# Altium schematic sheet ADC_PLL.SchDoc: RFSoC AMC
size 420 x 297 mm; CompanyName: WUT; DrawnBy: T. Przywozki; Organization: WUT ISE; Address1: Warsaw University of Technology; Address2: Nowowiejska 15/19 00-665 Warsaw; Address3: Tomasz.Przywozki@pw.edu.pl; DocumentNumber: 19; Revision: 1; SheetNumber: 19; SheetTotal: 45; Project: RFSoC AMC; ModifiedBy: T. Przywozki; CreateDate: -; CheckedDate: -; DivGrp: ISE; Designer: T. Przywozki; ModifiedDate: -; ProjectName: ADC/DAC MEZZANINE
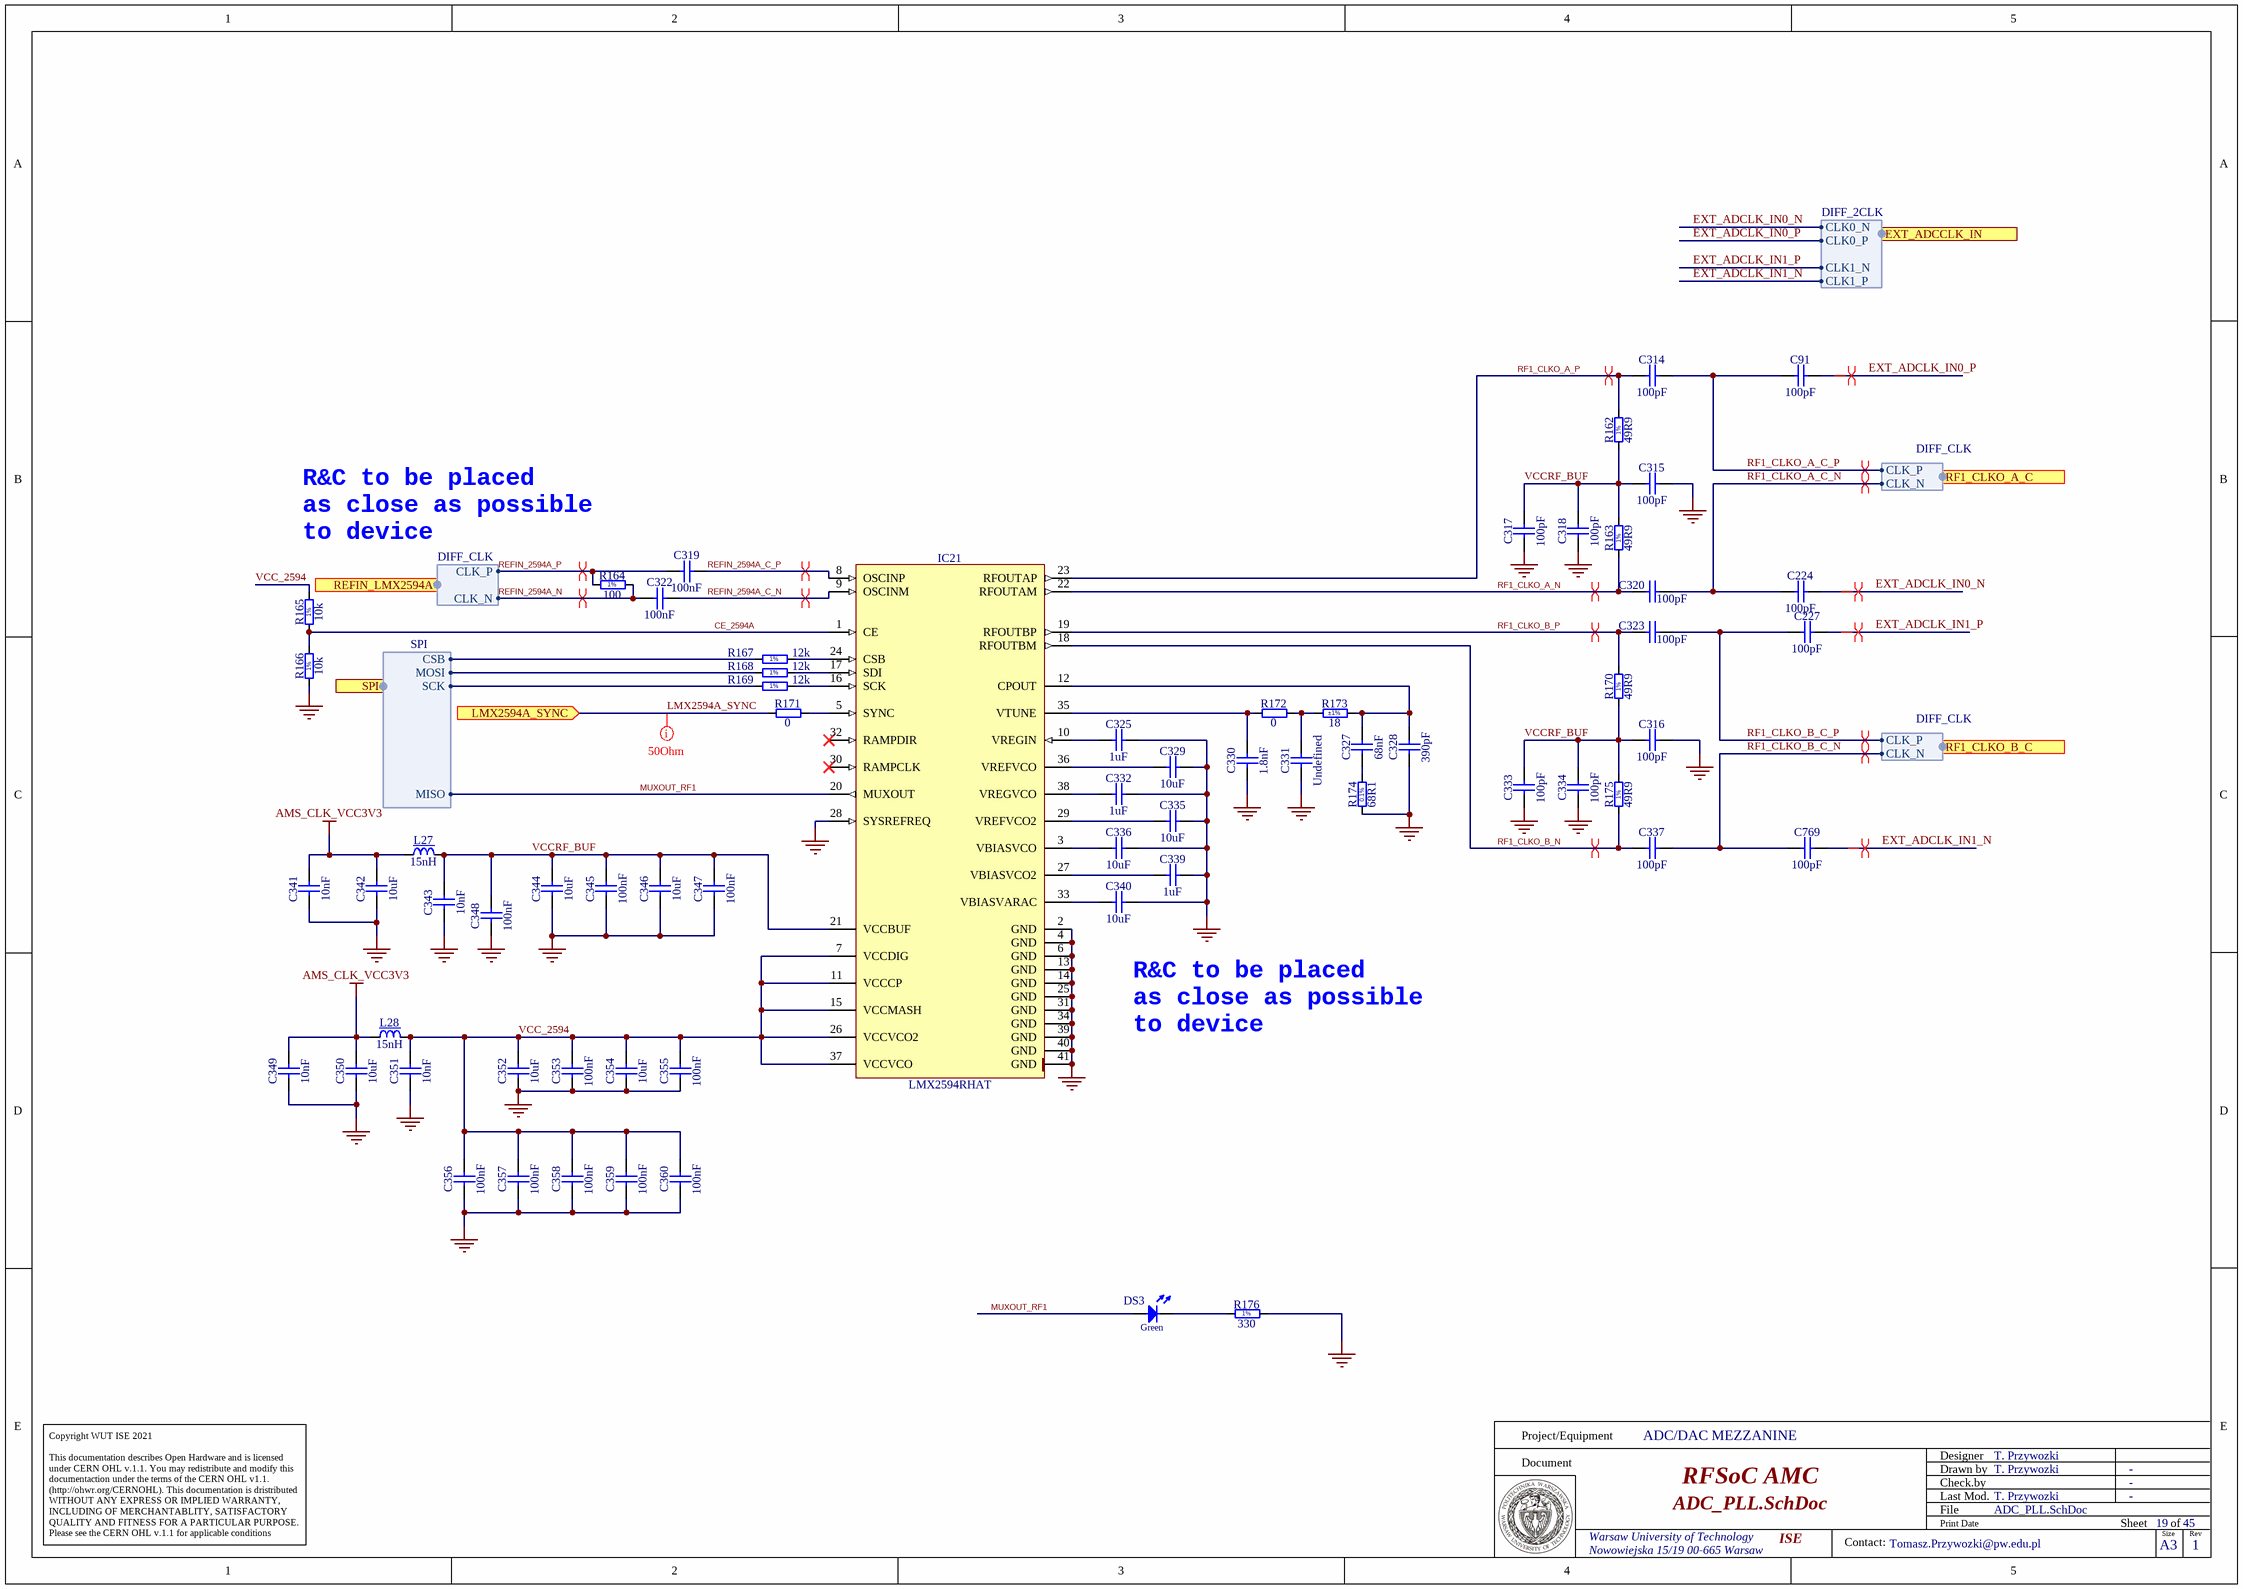
[diagram p0: ADC_PLL.SchDoc]

## Parts
C91  100pF  [CAPC1005X55N]
C224  100pF  [CAPC1005X55N]
C227  100pF  [CAPC1005X55N]
C314  100pF  [CAPC1005X55N]
C315  100pF  [CAPC1005X55N]
C316  100pF  [CAPC1005X55N]
C317  100pF  [CAPC1005X55N]
C318  100pF  [CAPC1005X55N]
C319  100nF  [CAPC1005X55N]
C320  100pF  [CAPC1005X55N]
C322  100nF  [CAPC1005X55N]
C323  100pF  [CAPC1005X55N]
C325  1uF  [CAPC1005X55N]
C327  68nF  [CAPC1005X55N]
C328  390pF  [CAPC1608X87N]
C329  10uF  [CAPC1608X80N]
C330  1.8nF  [CAPC1608X87N]
C331  Undefined  [CAPC1005X55N]
C332  1uF  [CAPC1005X55N]
C333  100pF  [CAPC1005X55N]
C334  100pF  [CAPC1005X55N]
C335  10uF  [CAPC1608X80N]
C336  10uF  [CAPC1608X80N]
C337  100pF  [CAPC1005X55N]
C339  1uF  [CAPC1005X55N]
C340  10uF  [CAPC1608X80N]
C341  10nF  [CAPC1005X55N]
C342  10uF  [CAPC1608X80N]
C343  10nF  [CAPC1005X55N]
C344  10uF  [CAPC1608X80N]
C345  100nF  [CAPC1005X55N]
C346  10uF  [CAPC1608X80N]
C347  100nF  [CAPC1005X55N]
C348  100nF  [CAPC1005X55N]
C349  10nF  [CAPC1005X55N]
C350  10uF  [CAPC1608X80N]
C351  10nF  [CAPC1005X55N]
C352  10uF  [CAPC1608X80N]
C353  100nF  [CAPC1005X55N]
C354  10uF  [CAPC1608X80N]
C355  100nF  [CAPC1005X55N]
C356  100nF  [CAPC1005X55N]
C357  100nF  [CAPC1005X55N]
C358  100nF  [CAPC1005X55N]
C359  100nF  [CAPC1005X55N]
C360  100nF  [CAPC1005X55N]
C769  100pF  [CAPC1005X55N]
DS3  Green  [LED_OSRAM_LGL29K]
IC21  LMX2594RHAT  [QFN50P600X600X100-41N-S460]
L27  15nH  [IND_COILCRAFT_0402DC]
L28  15nH  [IND_COILCRAFT_0402DC]
R162  49R9  [RESC1005X40N]
R163  49R9  [RESC1005X40N]
R164  100  [RESC1005X40N]
R165  10k  [RESC1005X40N]
R166  10k  [RESC1005X40N]
R167  12k  [RESC1005X40N]
R168  12k  [RESC1005X40N]
R169  12k  [RESC1005X40N]
R170  49R9  [RESC1005X40N]
R171  0  [RESC1005X40N]
R172  0  [RESC1005X40N]
R173  18  Tolerance: ±1%  [RESC1005X40N]
R174  68R1  [RESC1608X55N]
R175  49R9  [RESC1005X40N]
R176  330  [RESC1005X40N]

## Ports
EXT_ADCCLK_IN (harness DIFF_2CLK), LMX2594A_SYNC (in), REFIN_LMX2594A (harness DIFF_CLK), RF1_CLKO_A_C (harness DIFF_CLK), RF1_CLKO_B_C (in, harness DIFF_CLK), SPI (harness SPI)

## Harnesses
DIFF_CLK: CLK_P, CLK_N
SPI: MOSI, MISO, CSB, SCK
DIFF_2CLK: CLK0_P, CLK0_N, CLK1_P, CLK1_N

## Nets
AMS_CLK_VCC3V3: C341.2 C342.2 C349.2 C350.2 L27.1 L28.1
GND: C315.2 C316.2 C317.1 C318.1 C325.1 C328.1 C329.1 C330.1 C331.1 C332.1 C333.1 C334.1 C335.1 C336.1 C339.1 C340.1 C341.1 C342.1 C343.1 C344.1 C345.1 C346.1 C347.1 C348.1 C349.1 C350.1 C351.1 C352.1 C353.1 C354.1 C355.1 C356.1 C357.1 C358.1 C359.1 C360.1 IC21.2(GND) IC21.4(GND) IC21.6(GND) IC21.13(GND) IC21.14(GND) IC21.25(GND) IC21.28(SYSREFREQ) IC21.31(GND) IC21.34(GND) IC21.39(GND) IC21.40(GND) IC21.41(GND) R166.1 R174.1 R176.2
CE_2594A: IC21.1(CE) R165.1 R166.2
EXT_ADCLK_IN0_N: C224.2 ; port EXT_ADCCLK_IN.CLK0_N
EXT_ADCLK_IN0_P: C91.2 ; port EXT_ADCCLK_IN.CLK0_P
EXT_ADCLK_IN1_N: C769.2 ; port EXT_ADCCLK_IN.CLK1_P
EXT_ADCLK_IN1_P: C227.2 ; port EXT_ADCCLK_IN.CLK1_N
LMX2594A_SYNC: R171.1 ; port LMX2594A_SYNC
MUXOUT_RF1: DS3.2(A) IC21.20(MUXOUT) ; port SPI.MISO
REFIN_2594A_C_N: C322.2 IC21.9(OSCINM)
REFIN_2594A_C_P: C319.2 IC21.8(OSCINP)
REFIN_2594A_N: C322.1 R164.2 ; port REFIN_LMX2594A.CLK_N
REFIN_2594A_P: C319.1 R164.1 ; port REFIN_LMX2594A.CLK_P
RF1_CLKO_A_C_N: C224.1 C320.2 ; port RF1_CLKO_A_C.CLK_N
RF1_CLKO_A_C_P: C91.1 C314.2 ; port RF1_CLKO_A_C.CLK_P
RF1_CLKO_A_N: C320.1 IC21.22(RFOUTAM) R163.1
RF1_CLKO_A_P: C314.1 IC21.23(RFOUTAP) R162.2
RF1_CLKO_B_C_N: C337.2 C769.1 ; port RF1_CLKO_B_C.CLK_N
RF1_CLKO_B_C_P: C227.1 C323.2 ; port RF1_CLKO_B_C.CLK_P
RF1_CLKO_B_N: C337.1 IC21.18(RFOUTBM) R175.1
RF1_CLKO_B_P: C323.1 IC21.19(RFOUTBP) R170.2
VCC_2594: C351.2 C352.2 C353.2 C354.2 C355.2 C356.2 C357.2 C358.2 C359.2 C360.2 IC21.7(VCCDIG) IC21.11(VCCCP) IC21.15(VCCMASH) IC21.26(VCCVCO2) IC21.37(VCCVCO) L28.2 R165.2
VCCRF_BUF: C315.1 C316.1 C317.2 C318.2 C333.2 C334.2 C343.2 C344.2 C345.2 C346.2 C347.2 C348.2 IC21.21(VCCBUF) L27.2 R162.1 R163.2 R170.1 R175.2
NetC325_2: C325.2 IC21.10(VREGIN)
NetC327_1: C327.1 R174.2
NetC327_2: C327.2 C328.2 IC21.12(CPOUT) R173.2
NetC329_2: C329.2 IC21.36(VREFVCO)
NetC330_2: C330.2 IC21.35(VTUNE) R172.1
NetC331_2: C331.2 R172.2 R173.1
NetC332_2: C332.2 IC21.38(VREGVCO)
NetC335_2: C335.2 IC21.29(VREFVCO2)
NetC336_2: C336.2 IC21.3(VBIASVCO)
NetC339_2: C339.2 IC21.27(VBIASVCO2)
NetC340_2: C340.2 IC21.33(VBIASVARAC)
NetDS3_1: DS3.1(C) R176.1
NetIC21_5: IC21.5(SYNC) R171.2
NetIC21_16: IC21.16(SCK) R169.1
NetIC21_17: IC21.17(SDI) R168.1
NetIC21_24: IC21.24(CSB) R167.1
NetR167_2: R167.2 ; port SPI.CSB
NetR168_2: R168.2 ; port SPI.MOSI
NetR169_2: R169.2 ; port SPI.SCK

Not connected (* = marked no-connect by the designer): IC21 30(RAMPCLK)* 32(RAMPDIR)*

## Layout directives
differential pair; differential pair class Diff_100Ohm: EXT_ADCLK_IN0_N, EXT_ADCLK_IN0_P, EXT_ADCLK_IN1_N, EXT_ADCLK_IN1_P, REFIN_2594A_C_N, REFIN_2594A_C_P, REFIN_2594A_N, REFIN_2594A_P, RF1_CLKO_A_C_N, RF1_CLKO_A_C_P, RF1_CLKO_A_N, RF1_CLKO_A_P, RF1_CLKO_B_C_N, RF1_CLKO_B_C_P, RF1_CLKO_B_N, RF1_CLKO_B_P
mark named 50Ohm: LMX2594A_SYNC

## Notes on the sheet
- (near C319) R&C to be placed
  as close as possible
  to device
- R&C to be placed
  as close as possible
  to device
- Project/Equipment
- Document
- Designer
- Drawn by
- Check.by
- Copyright WUT ISE 2021
  This documentation describes Open Hardware and is licensed under CERN OHL v.1.1. You may redistribute and modify this documentaction under the terms of the CERN OHL v1.1.
  (http://ohwr.org/CERNOHL). This documentation is dristributed WITHOUT ANY EXPRESS OR IMPLIED WARRANTY, INCLUDING OF MERCHANTABLITY, SATISFACTORY QUALITY AND FITNESS FOR A PARTICULAR PURPOSE. Please see the CERN OHL v.1.1 for applicable conditions
- File
- Last Mod.
- Print Date
- Sheet
- Size
- A3
- of
- Rev
- Contact:
- (in symbol R0402_10K_1%_0.0625W_100PPM) 1%
- (in symbol R0402_12K_1%_0.0625W_100PPM) 1%
- (in symbol R0402_49R9_1%_0.0625W_100PPM) 1%
- (in symbol R0402_100R_1%_0.1W_100PPM) 1%
- (in symbol R0402_330R_1%_0.0625W_100PPM) 1%
- (in symbol R0603_68R1_0.1%_0.063W_10PPM) 0.1%

## Library data of the parts
C91 C224 C227 C314-C318 C320 C323 C333 C334 C337 C769 = CC0402_100PF_25V_5%_C0G_KEMET_HiQ-CBR: Non-polarised capacitor; Part Description: High Q and low ESR, SMD Multilayer Chip Ceramic Capacitor, HiQ-CBR Series; Manufacturer: KEMET; Manufacturer Part Number: CBR04C101J3GAC; Voltage: 25V; TC: C0G/NP0; Tolerance: ±5%; Part Number: CC0402_100PF_25V_5%_C0G_KEMET_HiQ-CBR; Component Kind: Standard; Component Type: Standard; Pin Count: 2; Value: 100pF; Status: Not Recommended; Case: 0402; Mounted: Yes; Socket: No; SMD: Yes; Sense: No; ComponentHeight: 0.55mm; HelpURL: \\cern.ch\dfs\Applications\Altium\Datasheets\CC0402_C0G_KEMET_HiQ-CBR.pdf; Author: CERN DEM MR; CreateDate: 17.11.2017; LatestRevisionDate: 21.11.2017
C319 C322 C345 C347 C348 C353 C355-C360 = CC0402_100NF_25V_10%_X7R_YUDEN_TMK105B7104KVHF: Non-polarised capacitor; Part Description: SMD Multilayer Chip Ceramic Capacitor (High Dielectric Type) for Automotive / Industrial Applications; Manufacturer: TAIYO YUDEN; Voltage: 25V; TC: X7R; Tolerance: ±10%; Part Number: CC0402_100NF_25V_10%_X7R_YUDEN_TMK105B7104KVHF; Component Kind: Standard; Component Type: Standard; Pin Count: 2; Value: 100nF; Status: Not Recommended; Manufacturer Part Number: TMK105B7104KVHF; Case: 0402; Mounted: Yes; Socket: No; SMD: Yes; Sense: No; ComponentHeight: 0.55mm; HelpURL: \\cern.ch\dfs\Applications\Altium\Datasheets\CC0402_TAIYO-YUDEN_TMK105B7104KVHF.pdf; Author: CERN DEM JLC; CreateDate: 10.05.2017; LatestRevisionDate: 10.05.2017
C325 C332 C339 = CC0402_1UF_16V_10%_X5R: Non-polarised capacitor; Part Description: SMD Multilayer Chip Ceramic Capacitor; Manufacturer: GENERIC; Manufacturer1 Part Number: C1005X5R1C105KT; Voltage: 16V; TC: X5R; Tolerance: ±10%; Part Number: CC0402_1UF_16V_10%_X5R; Component Kind: Standard; Component Type: Standard; Pin Count: 2; Value: 1uF; Status: Preferred; Manufacturer Part Number: CC0402_1UF_16V_10%_X5R; Case: 0402; Mounted: Yes; Socket: No; SMD: Yes; Sense: No; Manufacturer1 Example: TDK; Manufacturer1 ComponentHeight: 0.55mm; HelpURL: \\cern.ch\dfs\Applications\Altium\Datasheets\CC0402_X5R_TDK_C.pdf; Author: CERN DEM JLC; CreateDate: 25.10.2012; LatestRevisionDate: 25.10.2012
C327 = CC0402_68NF_16V_10%_X7R: Non-polarised capacitor; Part Description: SMD Multilayer Chip Ceramic Capacitor; Manufacturer: GENERIC; Manufacturer1 Part Number: 223878715647; Voltage: 16V; TC: X7R; Tolerance: ±10%; Part Number: CC0402_68NF_16V_10%_X7R; Component Kind: Standard; Component Type: Standard; Pin Count: 2; Value: 68nF; Status: Not Recommended; Manufacturer Part Number: CC0402_68NF_16V_10%_X7R; Case: 0402; Mounted: Yes; Socket: No; SMD: Yes; Sense: No; Manufacturer1 Example: PHYCOMP; Manufacturer1 ComponentHeight: 0.55mm; HelpURL: \\cern.ch\dfs\Applications\Altium\Datasheets\CC0402_X7R_PHYCOMP.pdf; Author: CERN DEM JLC; CreateDate: 03.12.2007; LatestRevisionDate: 03.12.2007
C328 = CC0603_390PF_50V_5%_NP0: Non-polarised capacitor; Part Description: SMD Multilayer Chip Ceramic Capacitor; Manufacturer: GENERIC; Manufacturer1 Part Number: 223886715391; Voltage: 50V; TC: NP0; Tolerance: ±5%; Part Number: CC0603_390PF_50V_5%_NP0; Component Kind: Standard; Component Type: Standard; Pin Count: 2; Value: 390pF; Status: Preferred; Manufacturer Part Number: CC0603_390PF_50V_5%_NP0; Case: 0603; Mounted: Yes; Socket: No; SMD: Yes; Sense: No; Manufacturer1 Example: PHYCOMP; Manufacturer1 ComponentHeight: 0.87mm; HelpURL: \\cern.ch\dfs\Applications\Altium\Datasheets\CC0603_NP0_PHYCOMP.pdf; Author: CERN DEM JLC; CreateDate: 03.12.2007; LatestRevisionDate: 03.12.2007
C329 C335 C336 C340 C342 C344 C346 C350 C352 C354 = CC0603_10UF_10V_10%_X5R: Non-polarised capacitor; Part Description: SMD Multilayer Chip Ceramic Capacitor; Manufacturer: GENERIC; Manufacturer1 Part Number: GRM188R61A106KE69D; Voltage: 10V; TC: X5R; Tolerance: ±10%; Part Number: CC0603_10UF_10V_10%_X5R; Component Kind: Standard; Component Type: Standard; Pin Count: 2; Value: 10uF; Status: None; Manufacturer Part Number: CC0603_10UF_10V_10%_X5R; Case: 0603; Mounted: Yes; Socket: No; SMD: Yes; Sense: No; Manufacturer1 Example: MURATA; Manufacturer1 ComponentHeight: 0.8mm; HelpURL: \\cern.ch\dfs\Applications\Altium\Datasheets\CC0603_MURATA_GRM188R61A106KE69D.pdf; Author: CERN DEM JLC; CreateDate: 31.01.2017; LatestRevisionDate: 31.01.2017
C330 = CC0603_1.8NF_50V_5%_X7R: Non-polarised capacitor; Part Description: SMD Multilayer Chip Ceramic Capacitor; Manufacturer: GENERIC; Manufacturer1 Part Number: C0603C182J5RACTU; Voltage: 50V; TC: X7R; Tolerance: ±5%; Part Number: CC0603_1.8NF_50V_5%_X7R; Component Kind: Standard; Component Type: Standard; Pin Count: 2; Value: 1.8nF; Status: Preferred; Manufacturer Part Number: CC0603_1.8NF_50V_5%_X7R; Case: 0603; Mounted: Yes; Socket: No; SMD: Yes; Sense: No; Manufacturer1 Example: KEMET; Manufacturer1 ComponentHeight: 0.87mm; HelpURL: \\cern.ch\dfs\Applications\Altium\Datasheets\CC0603_X7R_KEMET.pdf; Author: CERN DEM JLC; CreateDate: 31.05.2018; LatestRevisionDate: 31.05.2018
C331 = CC0402_NO-VALUE: Non-polarised capacitor; Part Description: Reserved Footprint For 0402(1005) Chip Ceramic Capacitor; Mounted: No; Part Number: CC0402_NO-VALUE; Component Kind: Standard; Component Type: Standard; Pin Count: 2; Value: Undefined; Status: None; Manufacturer: Undefined; Manufacturer Part Number: CC0402_NO-VALUE; Case: 0402; Socket: No; SMD: Yes; Sense: No; Manufacturer1 ComponentHeight: 0.55mm; HelpURL: Undefined; Author: CERN DEM JLC; CreateDate: 14.01.2014; LatestRevisionDate: 14.01.2014
C341 C343 C349 C351 = CC0402_10NF_16V_10%_X7R: Non-polarised capacitor; Part Description: SMD Multilayer Chip Ceramic Capacitor; Manufacturer: GENERIC; Manufacturer1 Part Number: 223878715636; Voltage: 16V; TC: X7R; Tolerance: ±10%; Part Number: CC0402_10NF_16V_10%_X7R; Component Kind: Standard; Component Type: Standard; Pin Count: 2; Value: 10nF; Status: Not Recommended; Manufacturer Part Number: CC0402_10NF_16V_10%_X7R; Case: 0402; Mounted: Yes; Socket: No; SMD: Yes; Sense: No; Manufacturer1 Example: PHYCOMP; Manufacturer1 ComponentHeight: 0.55mm; HelpURL: \\cern.ch\dfs\Applications\Altium\Datasheets\CC0402_X7R_PHYCOMP.pdf; Author: CERN DEM JLC; CreateDate: 03.12.2007; LatestRevisionDate: 03.12.2007
DS3 = LED_OSRAM_LG L29K-G2J1-24-Z: LED Green 1C 2A; Part Description: Surface Mount Green LED (0603 Case); Manufacturer: OSRAM; PressFit: No; Bonding: No; Status Comment: Sourcing Difficulty; Part Number: LED_OSRAM_LG L29K-G2J1-24-Z; Component Kind: Standard; Component Type: Standard; Color: Green; PackageDescription: Green Chip LED, 2-Leads, Body 1.7x0.8mm, IPC Medium Density; Status: Not Recommended; Manufacturer Part Number: LG L29K-G2J1-24-Z; Pin Count: 2; Case: 0603; Mounted: Yes; Socket: No; SMD: Yes; Sense: No; ComponentHeight: 0.67mm; HelpURL: \\cern.ch\dfs\Applications\Altium\Datasheets\LED_OSRAM_LGL29K.pdf; Author: CERN DEM JLC; CreateDate: 24.04.2012; LatestRevisionDate: 24.04.2012
IC21 = LMX2594RHAT: 15GHz Wideband PLLatinum RF Synthesizer with Phase Synchronization and JESD204B Support; Manufacturer: TEXAS INSTRUMENTS; PressFit: No; Bonding: No; Part Number: LMX2594RHAT; Component Kind: Standard; Component Type: Standard; Device: LMX2594RHAT; PackageDescription: QFN, 0.50mm Pitch, Square; 40 pin, 6.00mm L X 6.00mm W X 1.00mm H body (W/Thermal Tab 4.60mm x 4.60mm), IPC Medium Density; Part Description: 15GHz Wideband PLLatinum RF Synthesizer with Phase Synchronization and JESD204B Support; Manufacturer Part Number: LMX2594RHAT; Pin Count: 41; Case: QFN40; Mounted: Yes; Socket: No; SMD: Yes; Sense: No; ComponentHeight: 1mm; Author: CERN DEM JLC; HelpURL: \\cern.ch\dfs\Applications\Altium\Datasheets\LMX2594RHAT.pdf; CreateDate: 04.12.2018; LatestRevisionDate: 04.12.2018
L27 L28 = IND0402_15NH_2%_COILCRAFT_0402DC: Inductor With Core; Part Description: Ceramic Wirewound Chip Inductor, 0402DC Series; Manufacturer Part Number: 0402DC-15NXGRW; Power: 1A; Resistance: 0.115R; Tolerance: ±2%; Part Number: IND0402_15NH_2%_COILCRAFT_0402DC; Component Kind: Standard; Component Type: Standard; Pin Count: 2; Value: 15nH; Status: None; Manufacturer: COILCRAFT; Case: 0402; Mounted: Yes; Socket: No; SMD: Yes; Sense: No; ComponentHeight: 0.61mm; HelpURL: \\cern.ch\dfs\Applications\Altium\Datasheets\IND0402_COILCRAFT_0402DC.pdf; Author: CERN DEM JLC; CreateDate: 04.12.2018; LatestRevisionDate: 04.12.2018
R162 R163 R170 R175 = R0402_49R9_1%_0.0625W_100PPM: Resistor - 1%; Part Description: General Purpose Thick Film Chip Resistor; Manufacturer: GENERIC; Manufacturer1 Part Number: 232270674999L or RC0402FR-0749R9L; TC: ±100ppm/°C; PressFit: No; Part Number: R0402_49R9_1%_0.0625W_100PPM; Component Kind: Standard; Component Type: Standard; Pin Count: 2; Value: 49R9; Status: Not Recommended; Power: 0.0625W; Tolerance: ±1%; Manufacturer Part Number: R0402_49R9_1%_0.0625W_100PPM; Case: 0402; Mounted: Yes; Sense: No; Socket: No; SMD: Yes; Manufacturer1 Example: YAGEO PHYCOMP; Manufacturer1 ComponentHeight: 0.4mm; HelpURL: \\cern.ch\dfs\Applications\Altium\Datasheets\R0402_Phycomp_RC0402.pdf; Author: CERN DEM JLC; CreateDate: 24.10.2012; LatestRevisionDate: 24.10.2012
R164 = R0402_100R_1%_0.1W_100PPM: Resistor - 1%; Part Description: General Purpose Thick Film Chip Resistor; Manufacturer: GENERIC; Manufacturer Part Number: R0402_100R_1%_0.1W_100PPM_50V; Manufacturer1 Part Number: ERJ2RKF1000X; Power: 0.1W; TC: ±100ppm/°C; Voltage: 50V; PressFit: No; Part Number: R0402_100R_1%_0.1W_100PPM; Component Kind: Standard; Component Type: Standard; Pin Count: 2; Value: 100; Status: Not Recommended; Tolerance: ±1%; Case: 0402; Mounted: Yes; Sense: No; Socket: No; SMD: Yes; Manufacturer1 Example: PANASONIC; Manufacturer1 ComponentHeight: 0.4mm; HelpURL: \\cern.ch\dfs\Applications\Altium\Datasheets\R0402_PANASONIC_ERJ2RK.pdf; Author: CERN DEM JLC; CreateDate: 12.12.2013; LatestRevisionDate: 03.03.2015
R165 R166 = R0402_10K_1%_0.0625W_100PPM: Resistor - 1%; Part Description: General Purpose Thick Film Chip Resistor; Manufacturer: GENERIC; Manufacturer1 Part Number: 232270671003L; TC: ±100ppm/°C; PressFit: No; Part Number: R0402_10K_1%_0.0625W_100PPM; Component Kind: Standard; Component Type: Standard; Pin Count: 2; Value: 10k; Status: Not Recommended; Power: 0.0625W; Tolerance: ±1%; Manufacturer Part Number: R0402_10K_1%_0.0625W_100PPM; Case: 0402; Mounted: Yes; Sense: No; Socket: No; SMD: Yes; Manufacturer1 Example: YAGEO PHYCOMP; Manufacturer1 ComponentHeight: 0.4mm; HelpURL: \\cern.ch\dfs\Applications\Altium\Datasheets\R0402_Phycomp_RC0402.pdf; Author: CERN DEM JLC; CreateDate: 03.12.2007; LatestRevisionDate: 17.10.2012
R167-R169 = R0402_12K_1%_0.0625W_100PPM: Resistor - 1%; Part Description: General Purpose Thick Film Chip Resistor; Manufacturer: GENERIC; Manufacturer1 Part Number: 232270671203L; TC: ±100ppm/°C; PressFit: No; Part Number: R0402_12K_1%_0.0625W_100PPM; Component Kind: Standard; Component Type: Standard; Pin Count: 2; Value: 12k; Status: Not Recommended; Power: 0.0625W; Tolerance: ±1%; Manufacturer Part Number: R0402_12K_1%_0.0625W_100PPM; Case: 0402; Mounted: Yes; Sense: No; Socket: No; SMD: Yes; Manufacturer1 Example: YAGEO PHYCOMP; Manufacturer1 ComponentHeight: 0.4mm; HelpURL: \\cern.ch\dfs\Applications\Altium\Datasheets\R0402_Phycomp_RC0402.pdf; Author: CERN DEM JLC; CreateDate: 03.12.2007; LatestRevisionDate: 17.10.2012
R171 R172 = R0402_0R_JUMPER: Resistor; Part Description: 1A (0.05R Max DC Resistance) Zero Ohm Jumper; Manufacturer: GENERIC; Manufacturer1 Part Number: 232270591001L; PressFit: No; Part Number: R0402_0R_JUMPER; Component Kind: Standard; Component Type: Standard; Pin Count: 2; Value: 0; Status: Not Recommended; Manufacturer Part Number: R0402_0R_JUMPER; Case: 0402; Mounted: Yes; Sense: No; Socket: No; SMD: Yes; Manufacturer1 Example: YAGEO PHYCOMP; Manufacturer1 ComponentHeight: 0.4mm; HelpURL: \\cern.ch\dfs\Applications\Altium\Datasheets\R0402_Phycomp_RC0402.pdf; Author: CERN DEM JLC; CreateDate: 03.12.2007; LatestRevisionDate: 17.10.2012
R173 = R0402_18R_1%_0.0625W_100PPM: Resistor - 1%; Part Description: General Purpose Thick Film Chip Resistor; Manufacturer: GENERIC; Manufacturer1 Part Number: 232270671809L; TC: ±100ppm/°C; PressFit: No; Part Number: R0402_18R_1%_0.0625W_100PPM; Component Kind: Standard; Component Type: Standard; Pin Count: 2; Value: 18; Status: Not Recommended; Power: 0.0625W; Manufacturer Part Number: R0402_18R_1%_0.0625W_100PPM; Case: 0402; Mounted: Yes; Sense: No; Socket: No; SMD: Yes; Manufacturer1 Example: YAGEO PHYCOMP; Manufacturer1 ComponentHeight: 0.4mm; HelpURL: \\cern.ch\dfs\Applications\Altium\Datasheets\R0402_Phycomp_RC0402.pdf; Author: CERN DEM JLC; CreateDate: 03.12.2007; LatestRevisionDate: 17.10.2012
R174 = R0603_68R1_0.1%_0.063W_10PPM: Resistor - 0.1%; Part Description: Thin Film Chip Resistor; Manufacturer: GENERIC; Manufacturer1 Part Number: RN73C1J68R1BTDF; Power: 0.063W; TC: ±10ppm; PressFit: No; Part Number: R0603_68R1_0.1%_0.063W_10PPM; Component Kind: Standard; Component Type: Standard; Pin Count: 2; Value: 68R1; Status: Not Recommended; Tolerance: ±0.1%; Manufacturer Part Number: R0603_68R1_0.1%_0.063W_10PPM; Case: 0603; Mounted: Yes; Sense: No; Socket: No; SMD: Yes; Manufacturer1 Example: TYCO HOLSWORTHY; Manufacturer1 ComponentHeight: 0.5mm; HelpURL: \\cern.ch\dfs\Applications\Altium\Datasheets\R0603_Tyco_RN73.pdf; Author: CERN DEM JLC; CreateDate: 03.12.2007; LatestRevisionDate: 13.03.2008
R176 = R0402_330R_1%_0.0625W_100PPM: Resistor - 1%; Part Description: General Purpose Thick Film Chip Resistor; Manufacturer: GENERIC; Manufacturer1 Part Number: 232270673301L; TC: ±100ppm/°C; PressFit: No; Part Number: R0402_330R_1%_0.0625W_100PPM; Component Kind: Standard; Component Type: Standard; Pin Count: 2; Value: 330; Status: Not Recommended; Power: 0.0625W; Tolerance: ±1%; Manufacturer Part Number: R0402_330R_1%_0.0625W_100PPM; Case: 0402; Mounted: Yes; Sense: No; Socket: No; SMD: Yes; Manufacturer1 Example: YAGEO PHYCOMP; Manufacturer1 ComponentHeight: 0.4mm; HelpURL: \\cern.ch\dfs\Applications\Altium\Datasheets\R0402_Phycomp_RC0402.pdf; Author: CERN DEM JLC; CreateDate: 03.12.2007; LatestRevisionDate: 17.10.2012